# EAGLE design opti (EAGLE 9.5.2)
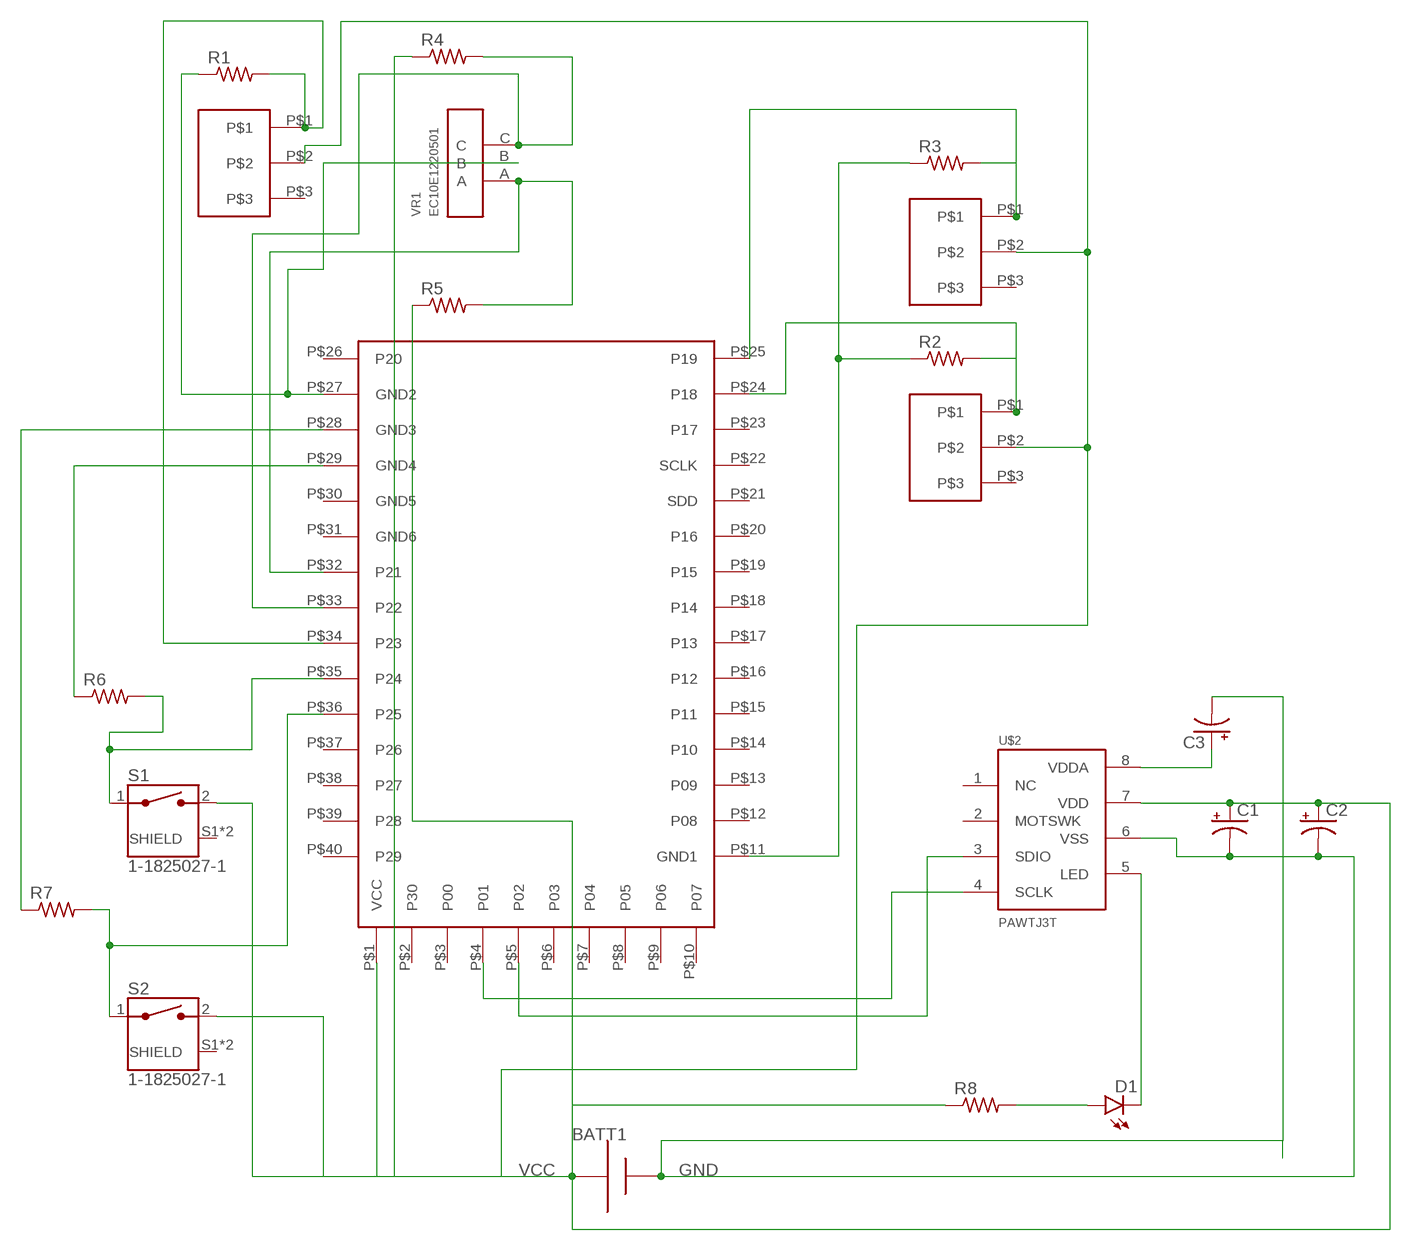
[diagram p0: schematic, sheet 1]

## Parts
BATT1  AAA  [12BH412]
C1  CAPACITOR-PE2-5  [E2-5]
C2  CAPACITOR-PE2-5  [E2-5]
C3  CAPACITOR-PE2-5  [E2-5]
D1  BEAGLEBONE_BLUE_LED-3MM-NO_SILK  [BEAGLEBONE_BLUE_BEAGLEBONE_BLUE_LED3MM-NS]
R1  R-US_0207/10  [0207/10]
R2  R-US_0207/10  [0207/10]
R3  R-US_0207/10  [0207/10]
R4  R-US_0207/10  [0207/10]
R5  R-US_0207/10  [0207/10]
R6  R-US_0207/10  [0207/10]
R7  R-US_0207/10  [0207/10]
R8  R-US_0207/10  [0207/10]
S1  1-1825027-1  [SW_1-1825027-1]
S2  1-1825027-1  [SW_1-1825027-1]
U$1  NRF51822-02  [WT51822-S2]
U$2  PAWTJ3T  [ADNS-2080]
U$3  D2FC  [D2FC]
U$4  D2FC  [D2FC]
U$5  D2FC  [D2FC]
VR1  EC10E1220501  [TRIM_EC10E1220501]

## Nets
GND: BATT1.+ C1.- C2.- C3.- U$2.6(VSS)
N$1: U$1.P$5(P02) U$2.3(SDIO)
N$2: U$1.P$4(P01) U$2.4(SCLK)
N$3: C3.+ U$2.8(VDDA)
N$4: R3.2 U$1.P$25(P19) U$5.P$1
N$5: R2.2 U$1.P$24(P18) U$4.P$1
N$6: R2.1 R3.1 U$1.P$11(GND1)
N$7: R4.2 U$1.P$33(P22) VR1.C
N$8: R5.2 U$1.P$32(P21) VR1.A
N$9: R6.2 S1.1 U$1.P$35(P24)
N$11: R7.2 S2.1 U$1.P$36(P25)
N$13: R1.1 U$1.P$27(GND2) VR1.B
N$14: R1.2 U$1.P$34(P23) U$3.P$1
N$16: R7.1 U$1.P$28(GND3)
N$17: R6.1 U$1.P$29(GND4)
N$20: D1.K(C) U$2.5(LED)
N$21: D1.A R8.2
VCC: BATT1.- C1.+ C2.+ R4.1 R5.1 R8.1 S1.2 S2.2 U$1.P$1(VCC) U$2.7(VDD) U$3.P$2 U$4.P$2 U$5.P$2
Unconnected: U$1.P$2(P30) U$1.P$3(P00) U$1.P$6(P03) U$1.P$7(P04) U$1.P$8(P05) U$1.P$9(P06) U$1.P$10(P07) U$1.P$12(P08) U$1.P$13(P09) U$1.P$14(P10) U$1.P$15(P11) U$1.P$16(P12) U$1.P$17(P13) U$1.P$18(P14) U$1.P$19(P15) U$1.P$20(P16) U$1.P$21(SDD) U$1.P$22(SCLK) U$1.P$23(P17) U$1.P$26(P20) U$1.P$30(GND5) U$1.P$31(GND6) U$1.P$37(P26) U$1.P$38(P27) U$1.P$39(P28) U$1.P$40(P29) U$2.1(NC) U$2.2(MOTSWK) U$3.P$3 U$4.P$3 U$5.P$3

## Power pins joined to a net without a drawn wire
SHIELD: S1.S1(SHIELD) S1.S2(SHIELD) S2.S1(SHIELD) S2.S2(SHIELD)

## Library data of the parts
BATT1 = adafruit:AAA: AAA PC pin holder Mouser part #12BH412 - but pretty much any 1x AAA battery holder should be the same http://www.ladyada.net/library/pcb/eaglelibrary.html
C1-C3 = BeagleBone_Blue_R3:CAPACITOR-P: POLARIZED CAPACITOR, American symbol
D1 = BeagleBone_Blue_R3:BEAGLEBONE_BLUE_LED: LEDs Standard schematic elements and footprints for 5mm, 3mm, 1206, and 0603 sized LEDs. 5mm - Spark Fun Electronics SKU : COM-00529 (and others)
R1-R8 = BeagleBone_Black_Wireless:R-US_: RESISTOR, American symbol
S1 S2 = 1-1825027-1:1-1825027-1: Switch Push Button OFF (ON) SPST Round Button 0.05A 24VDC Momentary Contact PC Pins Thru-Hole; AVAILABILITY: Unavailable; COMMENT: 1-1825027-1; DESCRIPTION: Switch Push Button OFF _ON_ SPST Round Button 0.05A 24VDC Momentary Contact PC Pins Thru-Hole; EU_ROHS_COMPLIANCE: Compliant; MF: TE Connectivity; MP: 1-1825027-1; PACKAGE: None; PRICE: None; TE_PURCHASE_URL: https://www.te.com/usa-en/product-1-1825027-1.html?te_bu=Cor&te_type=disp&te_campaign=seda_glo_cor-seda-global-disp-prtnr-fy19-seda-model-bom-cta_sma-317_1&elqCampaignId=32493
U$1 = nRF51-02:NRF51822-02
U$2 = ADNS-2080:PAW
U$3-U$5 = d2fc:D2FC
VR1 = EC10E1220501:EC10E1220501: Encoders 10mm 12 Res 24 Dtent 9mm mount height; AVAILABILITY: Unavailable; DESCRIPTION: Encoders 10mm 12 Res 24 Dtent 9mm mount height; MF: ALPS; MP: EC10E1220501; PACKAGE: None; PRICE: None

## Module *ADNS*
Ports: 

### Library data of the parts

## Board
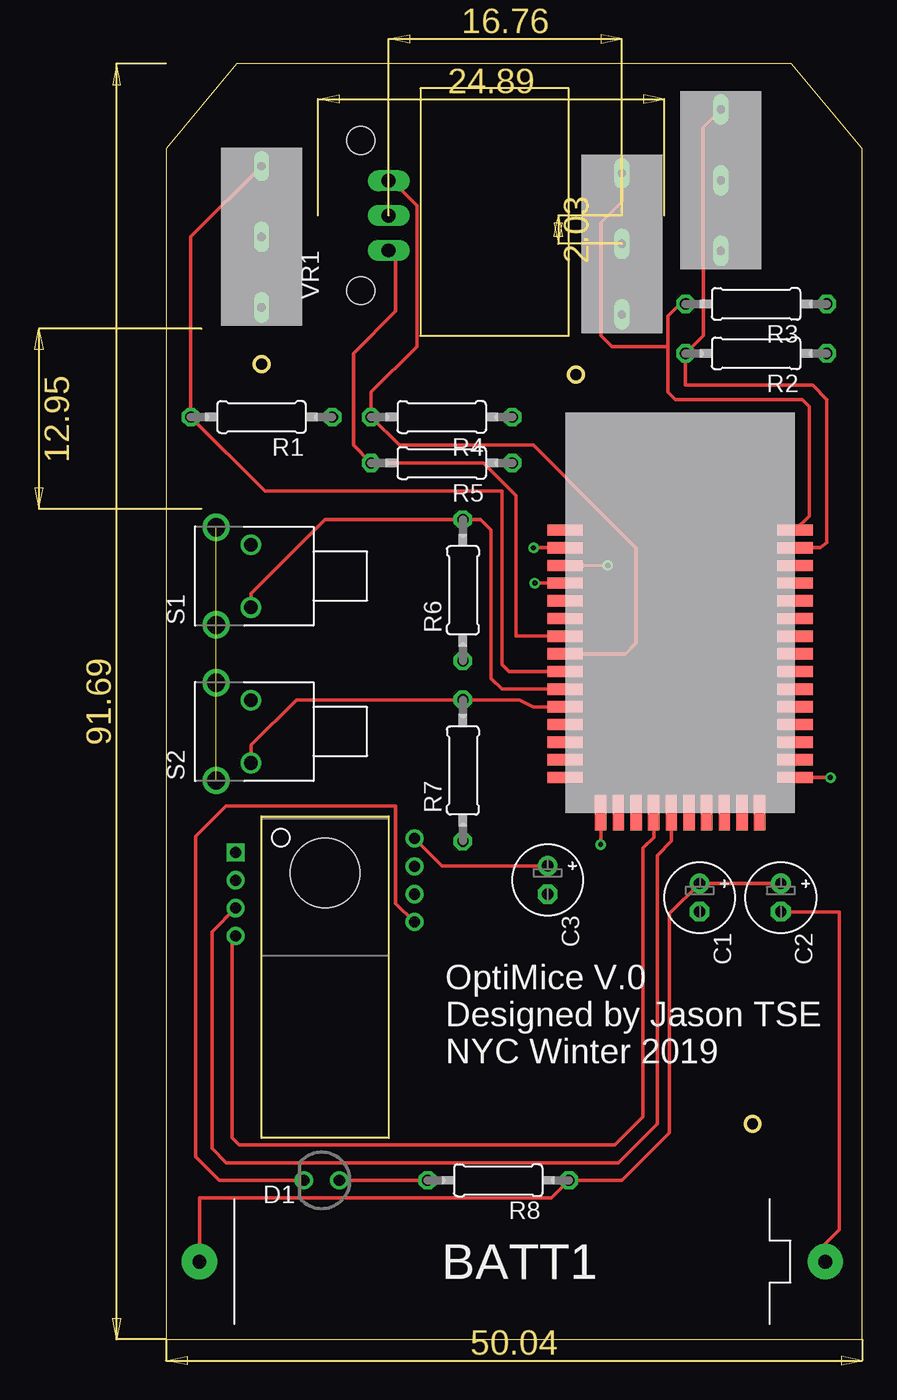
[diagram p1: board, top side]
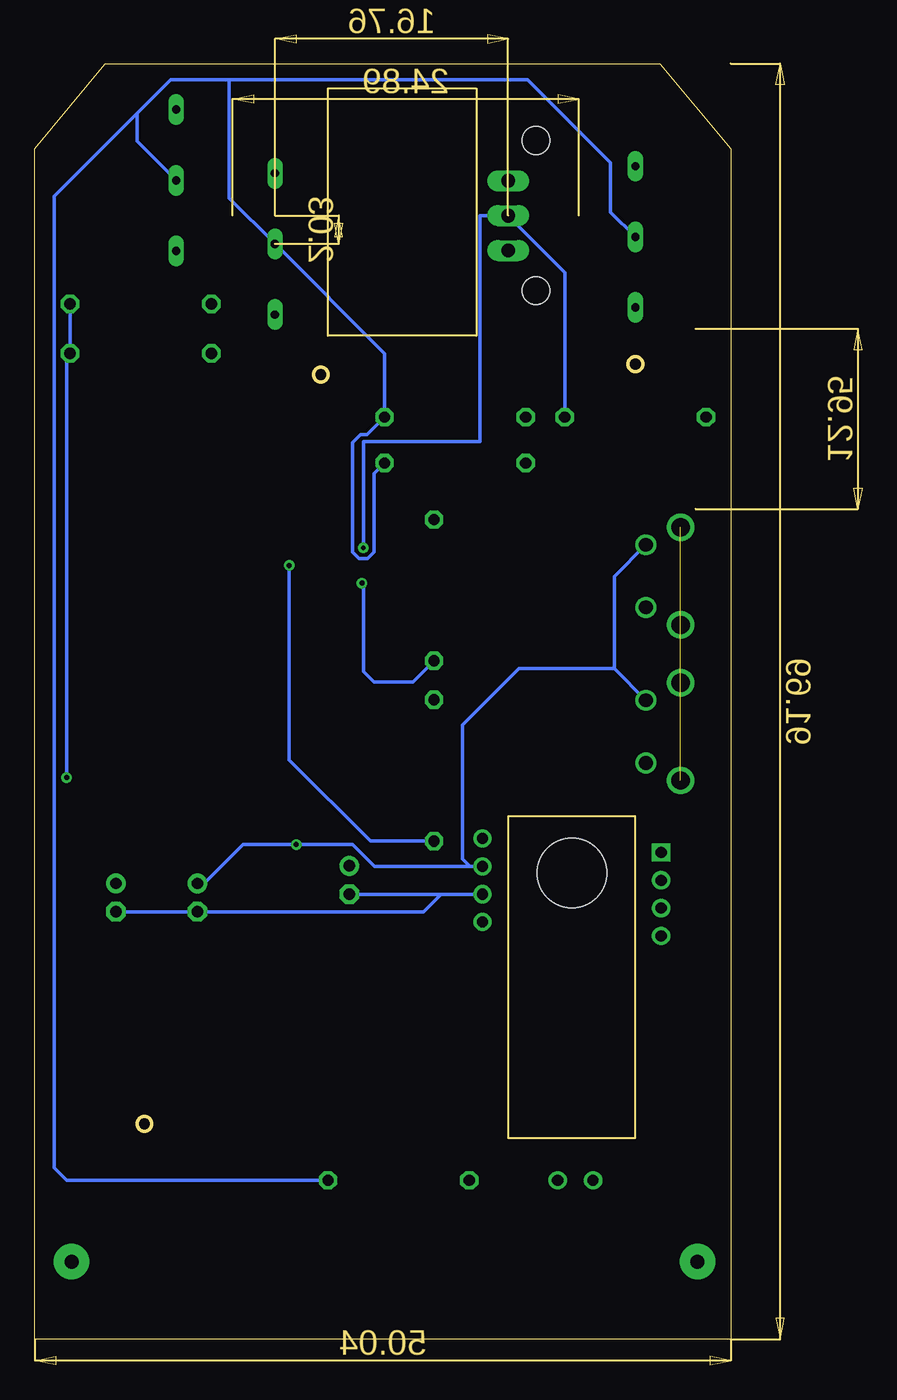
[diagram p2: board, bottom side, seen from below]

Size 50.04 x 91.69 mm. Coordinates in mm from the lower left corner, seen from the top.
Outline: 0,0 50.04,0 50.04,85.6 44.96,91.69 5.08,91.69 0,85.6 0,0
Copper layers (1*16): Top 0.035mm / dielectric 1.5mm / Bottom 0.035mm
Design rules "eagleRules": minimum track width 10mil, minimum drill 0.3mm, track to track 10mil, track to pad 10mil, pad to pad 10mil, via to via 10mil, smd to smd 10mil, copper to edge 20mil, drill to drill 20mil, minimum pad ring 10mil, minimum via ring 8mil, stop-mask expansion 4mil, vias tented up to drill 14mil, thermal gap 10mil
Milling: area 6.3,69.6 to 7.4,70.6; area 29,68.8 to 30,69.8; area 41.7,15 to 42.7,16; 8 lines

### Footprints (pad centres in the part's own frame; a part is rotated, then mirrored left to right if it is on the bottom)
12BH412 = drill 1 pad 2.54: + 22.5,0; - -22.5,0
E2-5 = drill 0.813 pad 1.422: + -1.016,0 | drill 0.813 pad 1.422 octagon: - 1.016,0
BEAGLEBONE_BLUE_BEAGLEBONE_BLUE_LED3MM-NS = drill 0.813: A -1.27,0; K 1.27,0
0207/10 = drill 0.813 octagon: 1 -5.08,0; 2 5.08,0
SW_1-1825027-1 = drill 0.99: 1 -2.25,0; 2 2.25,0 | drill 1.3: S1 -3.505,2.49; S2 3.505,2.49
WT51822-S2 = smd 2.54 x 0.81: P$1 0,-2.54; P$2 0,-3.81; P$3 0,-5.08; P$4 0,-6.35; P$5 0,-7.62; P$6 0,-8.89; P$7 0,-10.16; P$8 0,-11.43; P$9 0,-12.7; P$10 0,-13.97 | smd 0.81 x 2.54: P$11 2.54,-16.51; P$12 3.81,-16.51; P$13 5.08,-16.51; P$14 6.35,-16.51; P$15 7.62,-16.51; P$16 8.89,-16.51; P$17 10.16,-16.51; P$18 11.43,-16.51; P$19 12.7,-16.51; P$20 13.97,-16.51; P$21 15.24,-16.51; P$22 16.51,-16.51; P$23 17.78,-16.51; P$24 19.05,-16.51; P$25 20.32,-16.51; P$26 20.32,0; P$27 19.05,0; P$28 17.78,0; P$29 16.51,0; P$30 15.24,0; P$31 13.97,0; P$32 12.7,0; P$33 11.43,0; P$34 10.16,0; P$35 8.89,0; P$36 7.62,0; P$37 6.35,0; P$38 5.08,0; P$39 3.81,0; P$40 2.54,0
ADNS-2080 = drill 0.8 square: 1 6.425,-1.47 | drill 0.8: 2 6.425,0.53; 3 6.425,2.53; 4 6.425,4.53; 5 -6.425,3.53; 6 -6.425,1.53; 7 -6.425,-0.47; 8 -6.425,-2.47 | hole 5: 0,0
D2FC = drill 0.6 long: P$1 0,5.08; P$2 0,0; P$3 0,-5.08
TRIM_EC10E1220501 = drill 1 long: A -2.5,0; B 0,0; C 2.5,0 | hole 2: 5.4,2; -5.4,2

### Placement (x,y rotation side)
BATT1  24.89,5.59 0 top
C1  38.35,31.75 270 top
C2  44.2,31.75 270 top
C3  27.43,33.02 270 top
D1  11.18,11.43 180 top
R1  6.86,66.29 180 top
R2  42.42,70.87 180 top
R3  42.42,74.42 180 top
R4  19.81,66.29 180 top
R5  19.81,62.99 180 top
R6  21.34,53.85 90 top
R7  21.34,40.89 90 top
R8  23.88,11.43 180 top
S1  6.1,54.86 90 top
S2  6.1,43.69 90 top
U$1  28.7,37.85 90 top
U$2  11.43,33.53 180 top
U$3  6.86,79.25 0 top
U$4  39.88,83.31 0 top
U$5  32.77,78.74 0 top
VR1  16,80.77 90 top

### Tracks (layer width: path | path; a pad name or v marks a point on that pad's centre or on a via)
GND
  Top 0.254: C2.- 48.41,30.73 48.41,7.87 47.39,6.86 BATT1.+
  Bottom 0.254: C2.- C1.- 22.1,30.73 20.83,32 U$2.6 C3.-
N$1
  Top 0.254: U$2.3 3.3,29.3 3.3,13.72 4.32,12.7 32.51,12.7 35.31,15.49 35.31,34.8 36.32,35.81 U$1.P$5
N$2
  Top 0.254: U$2.4 4.75,28.74 4.75,14.48 5.26,13.97 32.26,13.97 34.29,16 34.29,35.31 35.05,36.07 U$1.P$4
N$3
  Top 0.254: U$2.8 19.82,34.04 C3.+
N$4
  Top 0.254: U$5.P$1 32.77,81.79 31.24,80.26 31.24,72.14 32.04,71.34 36.07,71.34 | 36.07,71.34 36.07,73.56 36.92,74.42 R3.2 | 36.07,71.34 36.07,68.1 36.61,67.56 45.72,67.56 46.23,67.06 46.23,59.18 U$1.P$25
N$5
  Top 0.254: U$4.P$1 38.61,87.12 38.61,72.14 R2.2 37.34,68.58 46.48,68.58 47.5,67.56 47.5,57.28 47.04,56.9 U$1.P$24
N$6  (via drill 0.35)
  Top 0.254: v47.75,40.39 U$1.P$11
  Bottom 0.254: R3.1 R2.1 47.75,70.61 v47.75,40.39
N$7
  Top 0.254: VR1.C 16.26,83.27 18.03,81.49 18.03,71.37 14.73,68.07 R4.2 16.76,64.26 26.42,64.26 33.78,56.9 33.78,50.04 33.02,49.28 U$1.P$33
N$8
  Top 0.254: VR1.A 16.51,77.76 16.51,73.91 13.46,70.87 13.46,64.26 R5.2 22.82,62.99 25.15,60.66 25.15,50.55 U$1.P$32
N$9
  Top 0.254: S1.1 6.1,53.59 11.43,58.93 R6.2 22.61,58.93 23.37,58.17 23.37,47.5 24.13,46.74 U$1.P$35
N$11
  Top 0.254: S2.1 6.1,42.71 9.36,45.97 R7.2 25.4,45.97 26.42,45.47 U$1.P$36
N$13  (via drill 0.35)
  Top 0.254: v26.42,56.9 U$1.P$27
  Bottom 0.254: v26.42,56.9 26.42,64.52 18.03,64.52 18.03,80.77 VR1.B 11.91,76.68 11.91,70.95 11.94,70.92 R1.1
N$14
  Top 0.254: U$3.P$1 1.78,79.25 R1.2 7.11,60.96 24.13,60.96 24.13,48.51 24.64,48.01 U$1.P$34
N$16  (via drill 0.35)
  Top 0.254: v31.75,55.63 U$1.P$28
  Bottom 0.254: R7.1 25.91,35.81 31.75,41.66 v31.75,55.63
N$17  (via drill 0.35)
  Top 0.254: v26.52,54.36 U$1.P$29
  Bottom 0.254: R6.1 22.86,47.24 25.65,47.24 26.42,48.01 26.42,54.26 v26.52,54.36
N$20
  Top 0.254: U$2.5 16.51,31.34 16.51,38.35 4.32,38.35 2.11,36.14 2.11,13.13 3.81,11.43 D1.K
N$21
  Top 0.254: R8.2 D1.A
SHIELD  (3 unrouted)
VCC  (via drill 0.35)
  Top 0.254: C2.+ C1.+ 36.2,30.61 36.2,14.86 32.77,11.43 R8.1 27.69,10.16 2.39,10.16 BATT1.- | v31.24,35.56 U$1.P$1
  Bottom 0.254: S1.2 8.38,54.83 8.38,48.22 | 8.38,48.22 15.24,48.22 19.3,44.16 19.3,34.54 18.76,34 U$2.7 25.62,34 27.18,35.56 v31.24,35.56 35.05,35.56 37.85,32.77 C1.+ | S2.2 8.38,48.22 | R8.1 47.75,11.43 48.65,12.33 48.65,82.16 42.67,88.14 | U$3.P$2 8.64,81.03 8.64,84.58 14.6,90.55 36.07,90.55 | 36.07,90.55 40.26,90.55 42.67,88.14 | 36.07,90.55 36.07,82.04 U$5.P$2 24.89,70.87 R4.1 26.16,65.02 26.63,65.02 27.18,64.47 27.18,56.58 26.73,56.14 26.1,56.14 25.66,56.58 25.66,62.23 R5.1 | U$4.P$2 42.67,86.11 42.67,88.14

### Text on the board
tNames: OptiMice V.0 / Designed by Jason TSE / NYC Winter 2019